# EAGLE design poas (EAGLE 9.7.0)
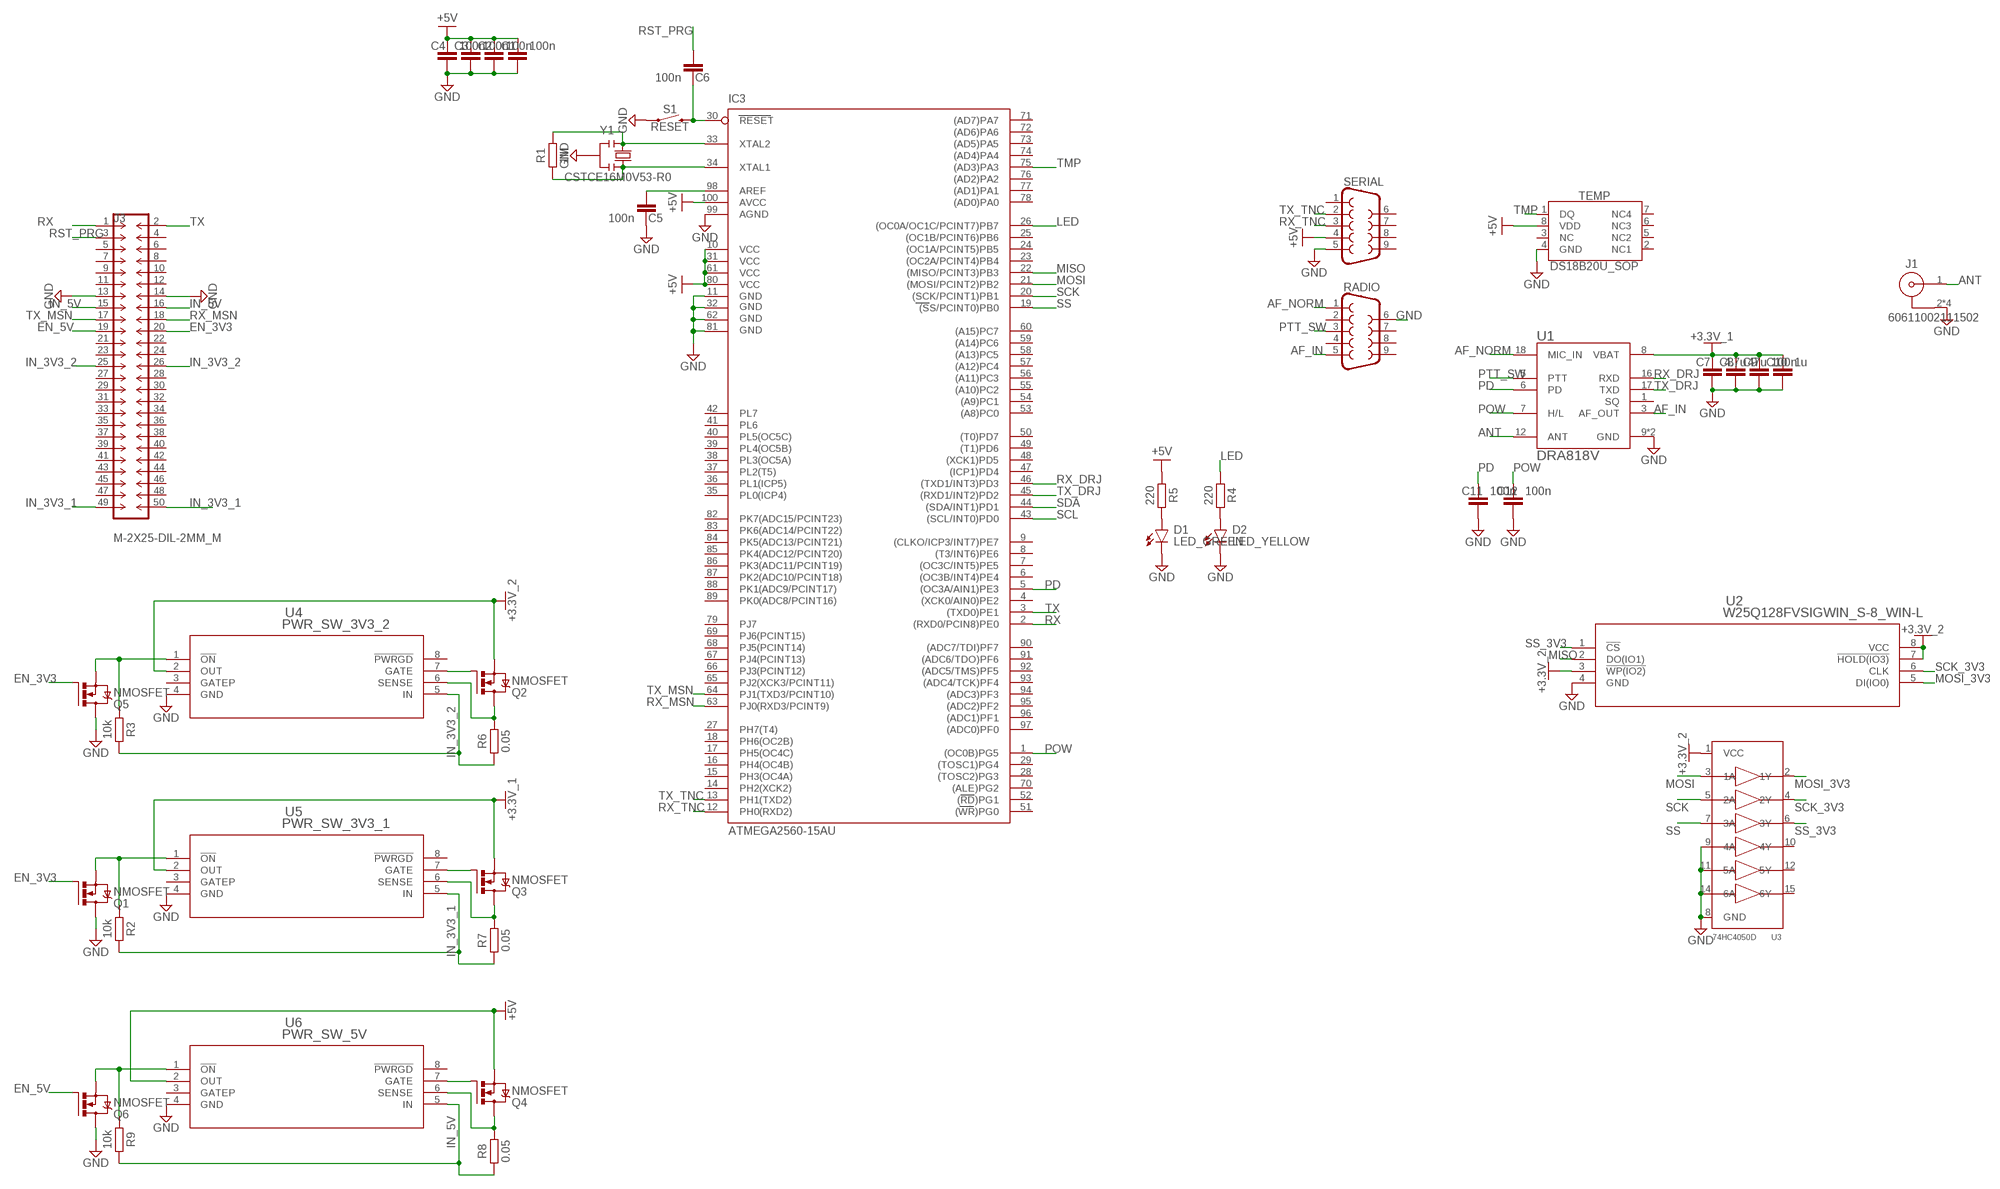
[diagram p0: schematic, sheet 1]

## Parts
C1  100n  C_CHIP-0603(1608-METRIC)  [CAPC1608X85]
C2  100n  C_CHIP-0603(1608-METRIC)  [CAPC1608X85]
C3  100n  C_CHIP-0603(1608-METRIC)  [CAPC1608X85]
C4  100n  C_CHIP-0603(1608-METRIC)  [CAPC1608X85]
C5  100n  C_CHIP-0603(1608-METRIC)  [CAPC1608X85]
C6  100n  C_CHIP-0603(1608-METRIC)  [CAPC1608X85]
C7  4.7u  C_CHIP-0603(1608-METRIC)  [CAPC1608X85]
C8  47u  C_CHIP-0603(1608-METRIC)  [CAPC1608X85]
C9  100n  C_CHIP-0603(1608-METRIC)  [CAPC1608X85]
C10  1u  C_CHIP-0603(1608-METRIC)  [CAPC1608X85]
C11  100n  C_CHIP-0603(1608-METRIC)  [CAPC1608X85]
C12  100n  C_CHIP-0603(1608-METRIC)  [CAPC1608X85]
D1  LED_GREEN  CHIP-FLAT-G_0603-0.55MM  [LEDC1608X55N_FLAT-G]
D2  LED_YELLOW  CHIP-FLAT-Y_0603-0.55MM  [LEDC1608X55N_FLAT-Y]
IC3  ATMEGA2560-15AU  0023_ATMEGA2560-16AU  [TQFP100]
J1  60611002111502  [60611002111502]
J3  M-2X25-DIL-2MM_M  [DIL-2MM-2X25_M]
Q1  NMOSFET  NMOSFETSOT23-GSD  [SOT23]
Q2  NMOSFET  NMOSFETSOT23-GSD  [SOT23]
Q3  NMOSFET  NMOSFETSOT23-GSD  [SOT23]
Q4  NMOSFET  NMOSFETSOT23-GSD  [SOT23]
Q5  NMOSFET  NMOSFETSOT23-GSD  [SOT23]
Q6  NMOSFET  NMOSFETSOT23-GSD  [SOT23]
R1  1M  R_CHIP-0603(1608-METRIC)  [RESC1608X60]
R2  10k  R_CHIP-0603(1608-METRIC)  [RESC1608X60]
R3  10k  R_CHIP-0603(1608-METRIC)  [RESC1608X60]
R4  220  R_CHIP-0603(1608-METRIC)  [RESC1608X60]
R5  220  R_CHIP-0603(1608-METRIC)  [RESC1608X60]
R6  0.05  R_CHIP-0603(1608-METRIC)  [RESC1608X60]
R7  0.05  R_CHIP-0603(1608-METRIC)  [RESC1608X60]
R8  0.05  R_CHIP-0603(1608-METRIC)  [RESC1608X60]
R9  10k  R_CHIP-0603(1608-METRIC)  [RESC1608X60]
RADIO  DB9MALE  [DB9_MALE]
S1  RESET  MOMENTARY-SWITCH-SPST-SMD-6.2MM-TALL  [TACTILE_SWITCH_SMD_6.2MM_TALL]
SERIAL  DB9MALE  [DB9_MALE]
TEMP  DS18B20U_SOP  [SOP65P491X110-8N]
U1  DRA818V  [DORJI_DRA818V]
U2  W25Q128FVSIGWIN_S-8_WIN-L  [WIN_S-8_WIN-L]
U3  74HC4050D  74HC4050DTSSOP  [TSSOP16]
U4  PWR_SW_3V3_2  LTC4361CTS8-2TRMPBFTSOT-23_TS8_LIT-L  [TSOT-23_TS8_LIT-L]
U5  PWR_SW_3V3_1  LTC4361CTS8-2TRMPBFTSOT-23_TS8_LIT-L  [TSOT-23_TS8_LIT-L]
U6  PWR_SW_5V  LTC4361CTS8-2TRMPBFTSOT-23_TS8_LIT-L  [TSOT-23_TS8_LIT-L]
Y1  CSTCE16M0V53-R0  0011_CSTCE16M0V53-R0  [RESONATOR]

## Nets
+3.3V_1: C7.1 C8.1 C9.1 C10.1 Q3.2(S) U1.8(VBAT) U5.2(OUT)
+3.3V_2: Q2.2(S) U2.3(!WP(IO2)) U2.7(!HOLD(IO3)) U2.8(VCC) U3.1(VCC) U4.2(OUT)
+5V: C1.1 C2.1 C3.1 C4.1 IC3.10(VCC) IC3.31(VCC1) IC3.61(VCC2) IC3.80(VCC3) IC3.100(AVCC) Q4.2(S) R5.1 SERIAL.4 TEMP.8(VDD) U6.2(OUT)
AF_IN: RADIO.5 U1.3(AF_OUT)
AF_NORM: RADIO.1 U1.18(MIC_IN)
ANT: J1.1 U1.12(ANT)
EN_3V3: J3.20 Q1.1(G) Q5.1(G)
EN_5V: J3.19 Q6.1(G)
GND: C1.2 C2.2 C3.2 C4.2 C5.1 C7.2 C8.2 C9.2 C10.2 C11.2 C12.2 D1.C D2.C IC3.11(GND) IC3.32(GND1) IC3.62(GND2) IC3.81(GND3) IC3.99(AGND) J1.2 J1.3 J1.4 J1.5 J3.13 J3.14 Q1.3(D) Q5.3(D) Q6.3(D) RADIO.6 S1.A2 SERIAL.5 TEMP.4(GND) U1.9(GND) U1.10(GND) U2.4(GND) U3.8(GND) U3.9(4A) U3.11(5A) U3.14(6A) U4.4(GND) U5.4(GND) U6.4(GND) Y1.2
IN_3V3_1: J3.49 J3.50 R2.2 R7.1 U5.5(IN)
IN_3V3_2: J3.25 J3.26 R3.2 R6.1 U4.5(IN)
IN_5V: J3.15 J3.16 R8.1 R9.2 U6.5(IN)
LED: IC3.26((OC0A/OC1C/PCINT7)PB7) R4.1
MISO: IC3.22((MISO/PCINT3)PB3) U2.2(DO(IO1))
MOSI: IC3.21((MOSI/PCINT2)PB2) U3.3(1A)
MOSI_3V3: U2.5(DI(IO0)) U3.2(1Y)
N$1: C5.2 IC3.98(AREF)
N$2: Q5.2(S) R3.1 U4.1(!ON)
N$3: Q1.2(S) R2.1 U5.1(!ON)
N$4: D1.A R5.2
N$5: D2.A R4.2
N$6: Q2.1(G) U4.7(GATE)
N$7: Q2.3(D) R6.2 U4.6(SENSE)
N$8: Q3.1(G) U5.7(GATE)
N$9: Q3.3(D) R7.2 U5.6(SENSE)
N$10: Q4.1(G) U6.7(GATE)
N$11: Q4.3(D) R8.2 U6.6(SENSE)
N$12: Q6.2(S) R9.1 U6.1(!ON)
PD: C11.1 IC3.5((OC3A/AIN1)PE3) U1.6(PD)
POW: C12.1 IC3.1((OC0B)PG5) U1.7(H/L)
PTT_SW: RADIO.3 U1.5(PTT)
RESET: C6.1 IC3.30(RESET) S1.B2
RST_PRG: C6.2 J3.3
RX: IC3.2((RXD0/PCIN8)PE0) J3.1
RX_DRJ: IC3.46((TXD1/INT3)PD3) U1.16(RXD)
RX_MSN: IC3.63(PJ0(RXD3/PCINT9)) J3.18
RX_TNC: IC3.12(PH0(RXD2)) SERIAL.3
SCK: IC3.20((SCK/PCINT1)PB1) U3.5(2A)
SCK_3V3: U2.6(CLK) U3.4(2Y)
SCL: IC3.43((SCL/INT0)PD0)
SDA: IC3.44((SDA/INT1)PD1)
SS: IC3.19((SS/PCINT0)PB0) U3.7(3A)
SS_3V3: U2.1(!CS) U3.6(3Y)
TMP: IC3.75((AD3)PA3) TEMP.1(DQ)
TX: IC3.3((TXD0)PE1) J3.2
TX_DRJ: IC3.45((RXD1/INT2)PD2) U1.17(TXD)
TX_MSN: IC3.64(PJ1(TXD3/PCINT10)) J3.17
TX_TNC: IC3.13(PH1(TXD2)) SERIAL.2
XTAL1: IC3.33(XTAL2) R1.2 Y1.1
XTAL2: IC3.34(XTAL1) R1.1 Y1.3
Unconnected: IC3.4((XCK0/AIN0)PE2) IC3.6((OC3B/INT4)PE4) IC3.7((OC3C/INT5)PE5) IC3.8((T3/INT6)PE6) IC3.9((CLKO/ICP3/INT7)PE7) IC3.14(PH2(XCK2)) IC3.15(PH3(OC4A)) IC3.16(PH4(OC4B)) IC3.17(PH5(OC4C)) IC3.18(PH6(OC2B)) IC3.23((OC2A/PCINT4)PB4) IC3.24((OC1A/PCINT5)PB5) IC3.25((OC1B/PCINT6)PB6) IC3.27(PH7(T4)) IC3.28((TOSC2)PG3) IC3.29((TOSC1)PG4) IC3.35(PL0(ICP4)) IC3.36(PL1(ICP5)) IC3.37(PL2(T5)) IC3.38(PL3(OC5A)) IC3.39(PL4(OC5B)) IC3.40(PL5(OC5C)) IC3.41(PL6) IC3.42(PL7) IC3.47((ICP1)PD4) IC3.48((XCK1)PD5) IC3.49((T1)PD6) IC3.50((T0)PD7) IC3.51((WR)PG0) IC3.52((RD)PG1) IC3.53((A8)PC0) IC3.54((A9)PC1) IC3.55((A10)PC2) IC3.56((A11)PC3) IC3.57((A12)PC4) IC3.58((A13)PC5) IC3.59((A14)PC6) IC3.60((A15)PC7) IC3.65(PJ2(XCK3/PCINT11)) IC3.66(PJ3(PCINT12)) IC3.67(PJ4(PCINT13)) IC3.68(PJ5(PCINT14)) IC3.69(PJ6(PCINT15)) IC3.70((ALE)PG2) IC3.71((AD7)PA7) IC3.72((AD6)PA6) IC3.73((AD5)PA5) IC3.74((AD4)PA4) IC3.76((AD2)PA2) IC3.77((AD1)PA1) IC3.78((AD0)PA0) IC3.79(PJ7) IC3.82(PK7(ADC15/PCINT23)) IC3.83(PK6(ADC14/PCINT22)) IC3.84(PK5(ADC13/PCINT21)) IC3.85(PK4(ADC12/PCINT20)) IC3.86(PK3(ADC11/PCINT19)) IC3.87(PK2(ADC10/PCINT18)) IC3.88(PK1(ADC9/PCINT17)) IC3.89(PK0(ADC8/PCINT16)) IC3.90((ADC7/TDI)PF7) IC3.91((ADC6/TDO)PF6) IC3.92((ADC5/TMS)PF5) IC3.93((ADC4/TCK)PF4) IC3.94((ADC3)PF3) IC3.95((ADC2)PF2) IC3.96((ADC1)PF1) IC3.97((ADC0)PF0) J3.4 J3.5 J3.6 J3.7 J3.8 J3.9 J3.10 J3.11 J3.12 J3.21 J3.22 J3.23 J3.24 J3.27 J3.28 J3.29 J3.30 J3.31 J3.32 J3.33 J3.34 J3.35 J3.36 J3.37 J3.38 J3.39 J3.40 J3.41 J3.42 J3.43 J3.44 J3.45 J3.46 J3.47 J3.48 RADIO.2 RADIO.4 RADIO.7 RADIO.8 RADIO.9 SERIAL.1 SERIAL.6 SERIAL.7 SERIAL.8 SERIAL.9 TEMP.2(NC1) TEMP.3(NC) TEMP.5(NC2) TEMP.6(NC3) TEMP.7(NC4) U1.1(SQ) U3.10(4Y) U3.12(5Y) U3.15(6Y) U4.3(GATEP) U4.8(!PWRGD) U5.3(GATEP) U5.8(!PWRGD) U6.3(GATEP) U6.8(!PWRGD)

## Library data of the parts
C1-C12 = Capacitor:C: Capacitor - Generic; CATEGORY: Capacitor
D1 = LED:CHIP-FLAT-G; CATEGORY: LED; COLOR: GREEN; DESCRIPTION: CHIP LED FLAT; SUB-CATEGORY: CHIP; TYPE: FLAT_TOP
D2 = LED:CHIP-FLAT-Y; CATEGORY: LED; COLOR: YELLOW; DESCRIPTION: CHIP LED FLAT; SUB-CATEGORY: CHIP; TYPE: FLAT_TOP
IC3 = IntegratedCircuits:0023_ATMEGA2560-16AU: 8-bit Microcontroller with 256K Bytes In-System Programmable Flash - ATMEGA2560-16AU; CASE: TQFP100_14x14; MONTHLY_USAGE: _____; PART_NUMBER: ATMEGA2560-16AU; PRICE: _____; SUPPLIER: _____; TYPE: Circuito_Integrato
J1 = Wurth_Connectors_WR-MCX:60611002111502: WR-MCX Right Angle Solder Leg 1.73mm MATERIAL PROPERTIES Insulator Material PTFE Center Contact Material Beryllium Copper Center Contact Plating Gold, min. 0.076µm over Nickel Body Material Brass Body Plating Gold, min. 0.076µm over Nickel KIND PROPERTIES Interface IEC 61169-36 Connector Type MCX Gender Jack Orientation Type Right Angle GENERAL INFORMATION Operating Temperature -55 up to +155 °C ELECTRICAL PROPERTIES Impedance 50 Ω Frequency Range DC~6 GHz MECHANICAL PROPERTIES Mating Cycle 500 Cycles PACKAGINGPROPERTIES Qty. 180 <https://www.we-online.com/catalog/media/o150546v209%20Family_WR-MCX_60611002111502.jpg> Details see: https://www.we-online.com/katalog/en/em/WR-MCX_60611002111502 Updated by Ella Wu 2019-11-04 2019 (C) Würth Elektronik; DATASHEET-URL: https://katalog.we-online.com/em/datasheet/60611002111502.pdf; GENDER: Jack; MOUNT: THT; PART-NUMBER: 60611002111502; Z: 50Ohm
J3 = Library:M-2X25-: MALE HEADER
Q1-Q6 = Transistor:NMOSFET: N-Channel MOSFET - Generic; CATEGORY: Transistor; SUB-CATEGORY: MOSFET; TYPE: N-Channel
R1-R9 = Resistor:R: Resistor Fixed - Generic; CATEGORY: Resistor; SUB-CATEGORY: Fixed
RADIO SERIAL = SparkFun-Connectors:DB9: DB9 Connector Standard DB9 (D-Sub 9) serial connector. Can be used for CAN bus as well as RS485 and RS232. Footprint production proven. Here is the female version connector we sell at SparkFun: 9 Pin Female Serial Connector - PCB Mount <https://www.sparkfun.com/products/429> (PRT-00429) This connector has been used on the following SparkFun products: SparkFun RS232 Shifter - SMD <https://www.sparkfun.com/products/449> (PRT-00449) SparkFun RS232 Shifter SMD (No DB9) <https://www.sparkfun.com/products/8780> (PRT-08780); PROD_ID: CONN-09904
S1 = SparkFun-Switches:MOMENTARY-SWITCH-SPST: Momentary Switch (Pushbutton) - SPST Normally-open (NO) SPST momentary switches (buttons, pushbuttons). Variants PTH-12MM - 12mm square, through-hole Momentary Pushbutton Switch - 12mm Square <https://www.sparkfun.com/products/9190> (COM-09190) PTH-6.0MM, PTH-6.0MM-KIT - 6.0mm square, through-hole Mini Pushbutton Switch <https://www.sparkfun.com/products/97> (COM-00097) KIT package intended for soldering kit's - only one side of pads' copper is exposed. PTH-RIGHT-ANGLE-KIT - Right-angle, through-hole Right Angle Tactile Button <https://www.sparkfun.com/products/10791> - Used on SparkFun BigTime Watch Kit <https://www.sparkfun.com/products/11734> SMD-12MM - 12mm square, surface-mount Tactile Button - SMD (12mm) <https://www.sparkfun.com/products/12993> (COM-12993) Used on SparkFun PicoBoard <https://www.sparkfun.com/products/11888> SMD-4.5MM - 4.5mm Square Trackball Switch Used on SparkFun Blackberry Trackballer Breakout <https://www.sparkfun.com/products/13169> SMD-4.6MMX2.8MM - 4.60mm x 2.80mm, surface mount Used on SparkFun SAMD21 Mini Breakout <https://www.sparkfun.com/products/13664> SMD-5.2MM, SMD-5.2-REDUNDANT - 5.2mm square, surface-mount Mini Pushbutton Switch - SMD <https://www.sparkfun.com/products/8720> (COM-08720) Used on Arduino Pro Mini <https://www.sparkfun.com/products/11114> REDUNDANT package connects both switch circuits together SMD-6.0X3.5MM - 6.0 x 3.5mm, surface mount Momentary Reset Switch SMD <https://www.sparkfun.com/products/8229> (COM-08229) SMD-6.2MM-TALL - 6.2mm square, surface mount Tactile Button - SMD (6mm) <https://www.sparkfun.com/products/12992> Used on SparkFun Digital Sandbox <https://www.sparkfun.com/products/12651> SMD-RIGHT-ANGLE - Right-angle, surface mount Used on SparkFun Block for Intel® Edison - Arduino <https://www.sparkfun.com/products/13036>; PROD_ID: SWCH-11966; SF_SKU: COM-12992
TEMP = Sensor:DS18B20U: Programmable Resolution 1-Wire Digital Thermometer. Datasheet <https://datasheets.maximintegrated.com/en/ds/DS18B20.pdf>
U1 = DRA818V:DRA818V: VHF Band Voice Transceiver Module; MANUFACTURER: DORJI; PART_REV: 1.23; STANDARD: MANUFACTURER RECOMMENDATIONS
U2 = 2023-07-10_06-57-03_Library:W25Q128FVSIG; COPYRIGHT: Copyright (C) 2023 Ultra Librarian. All rights reserved.; MANUFACTURER_PART_NUMBER: W25Q128FVSIG; MFR_NAME: Winbond
U3 = microbuilder:74HC4050D: 6-channel level shifter 74HC4050D - 2V-6V Supply SOIC16 Digikey: 74HC4050D,653-ND Mouser: 771-74HC4050D-T TSSOP16 Digikey: 296-9215-1-ND Mouser:
U4-U6 = 2023-07-11_07-55-04_Library:LTC4361CTS8-2TRMPBF; COPYRIGHT: Copyright (C) 2023 Ultra Librarian. All rights reserved.; MANUFACTURER_PART_NUMBER: LTC4361CTS8-2#TRMPBF; MFR_NAME: Analog Devices Inc
Y1 = Cristalli:0011_CSTCE16M0V53-R0: 16Mhz - SMD; MONTHLY_USAGE: _____; PART_NUMBER: CSTCE16M0V53-R0; PRICE: _____; SUPPLIER: _____; TYPE: Cristalli

## Board
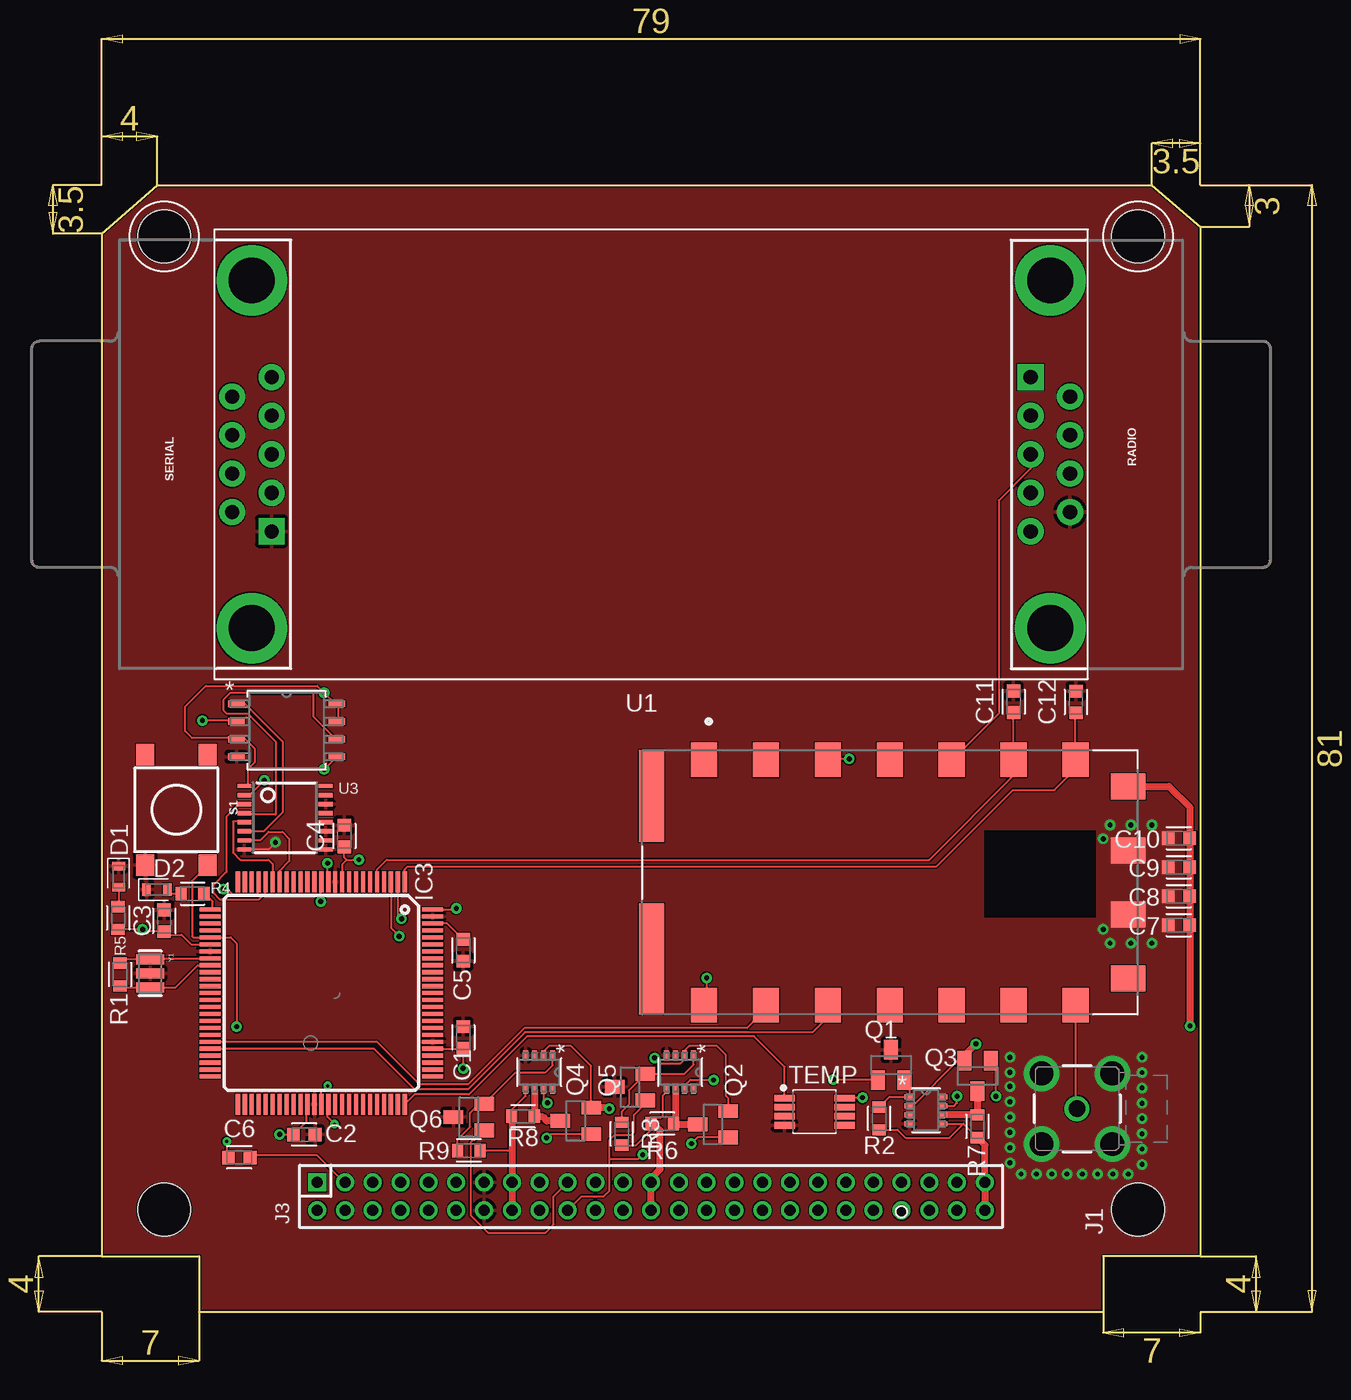
[diagram p1: board, top side]
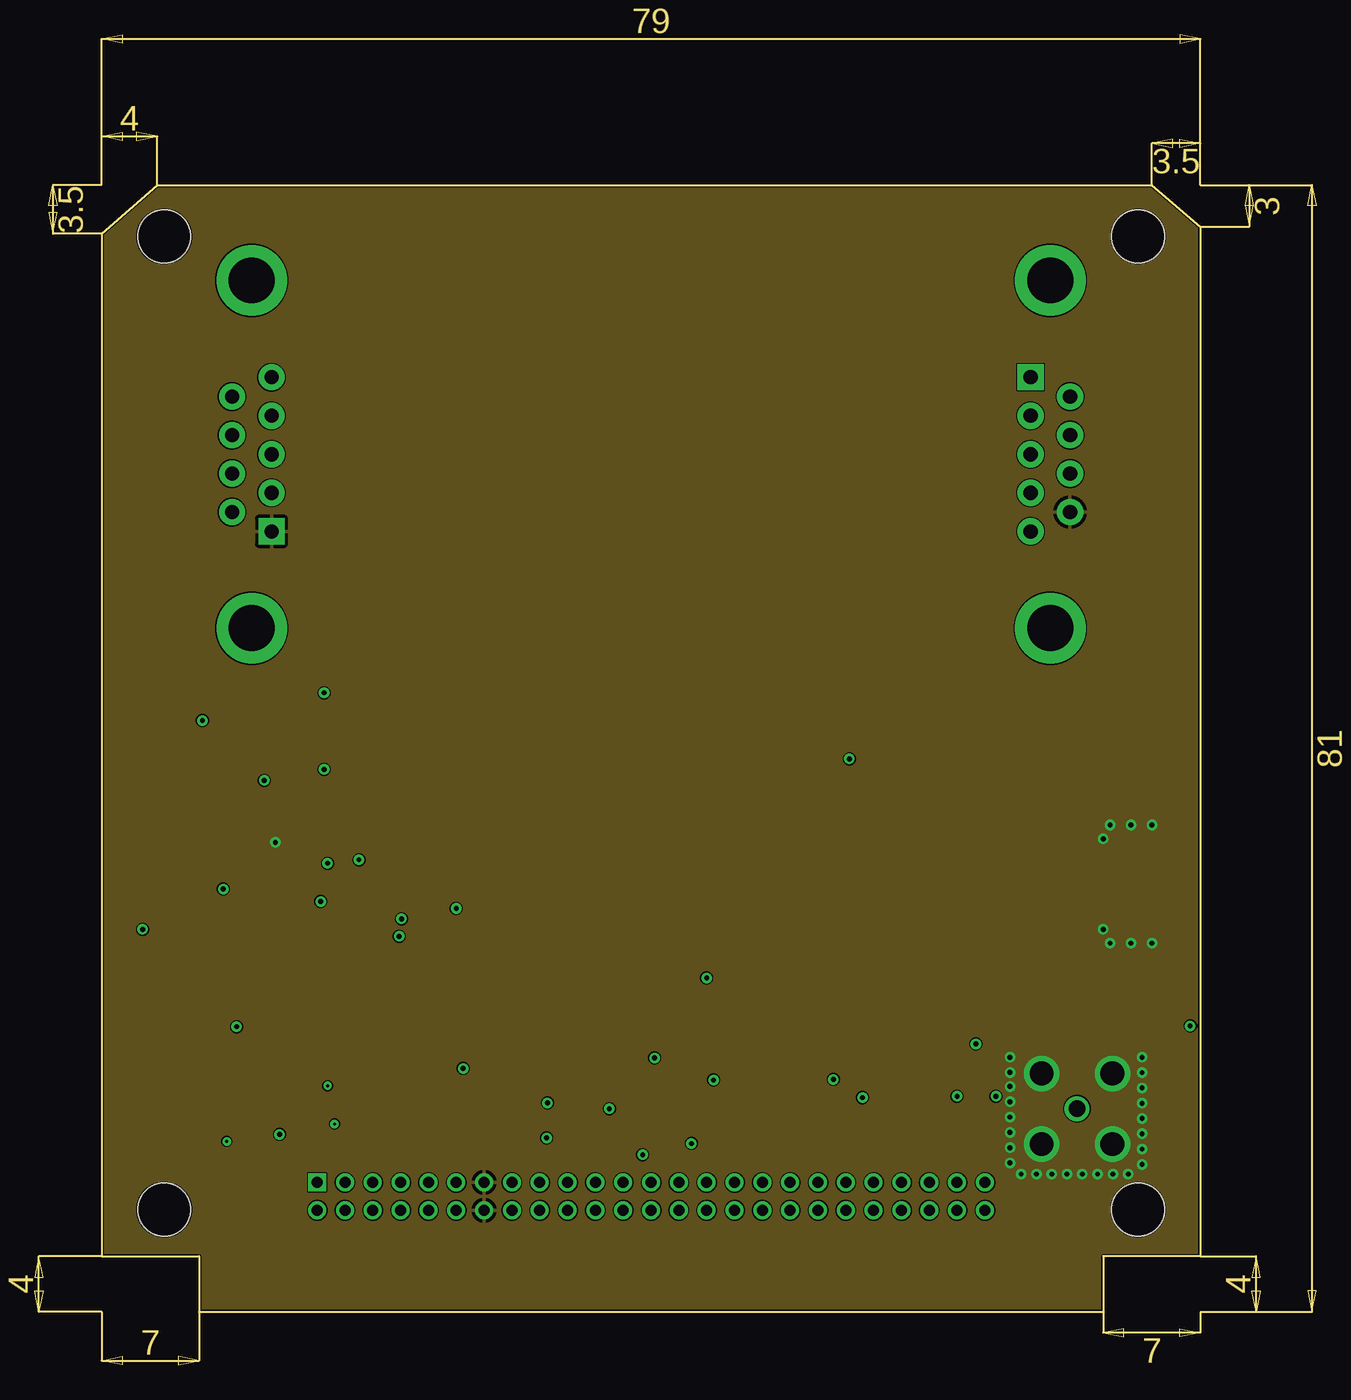
[diagram p2: board, inner layer Route2]
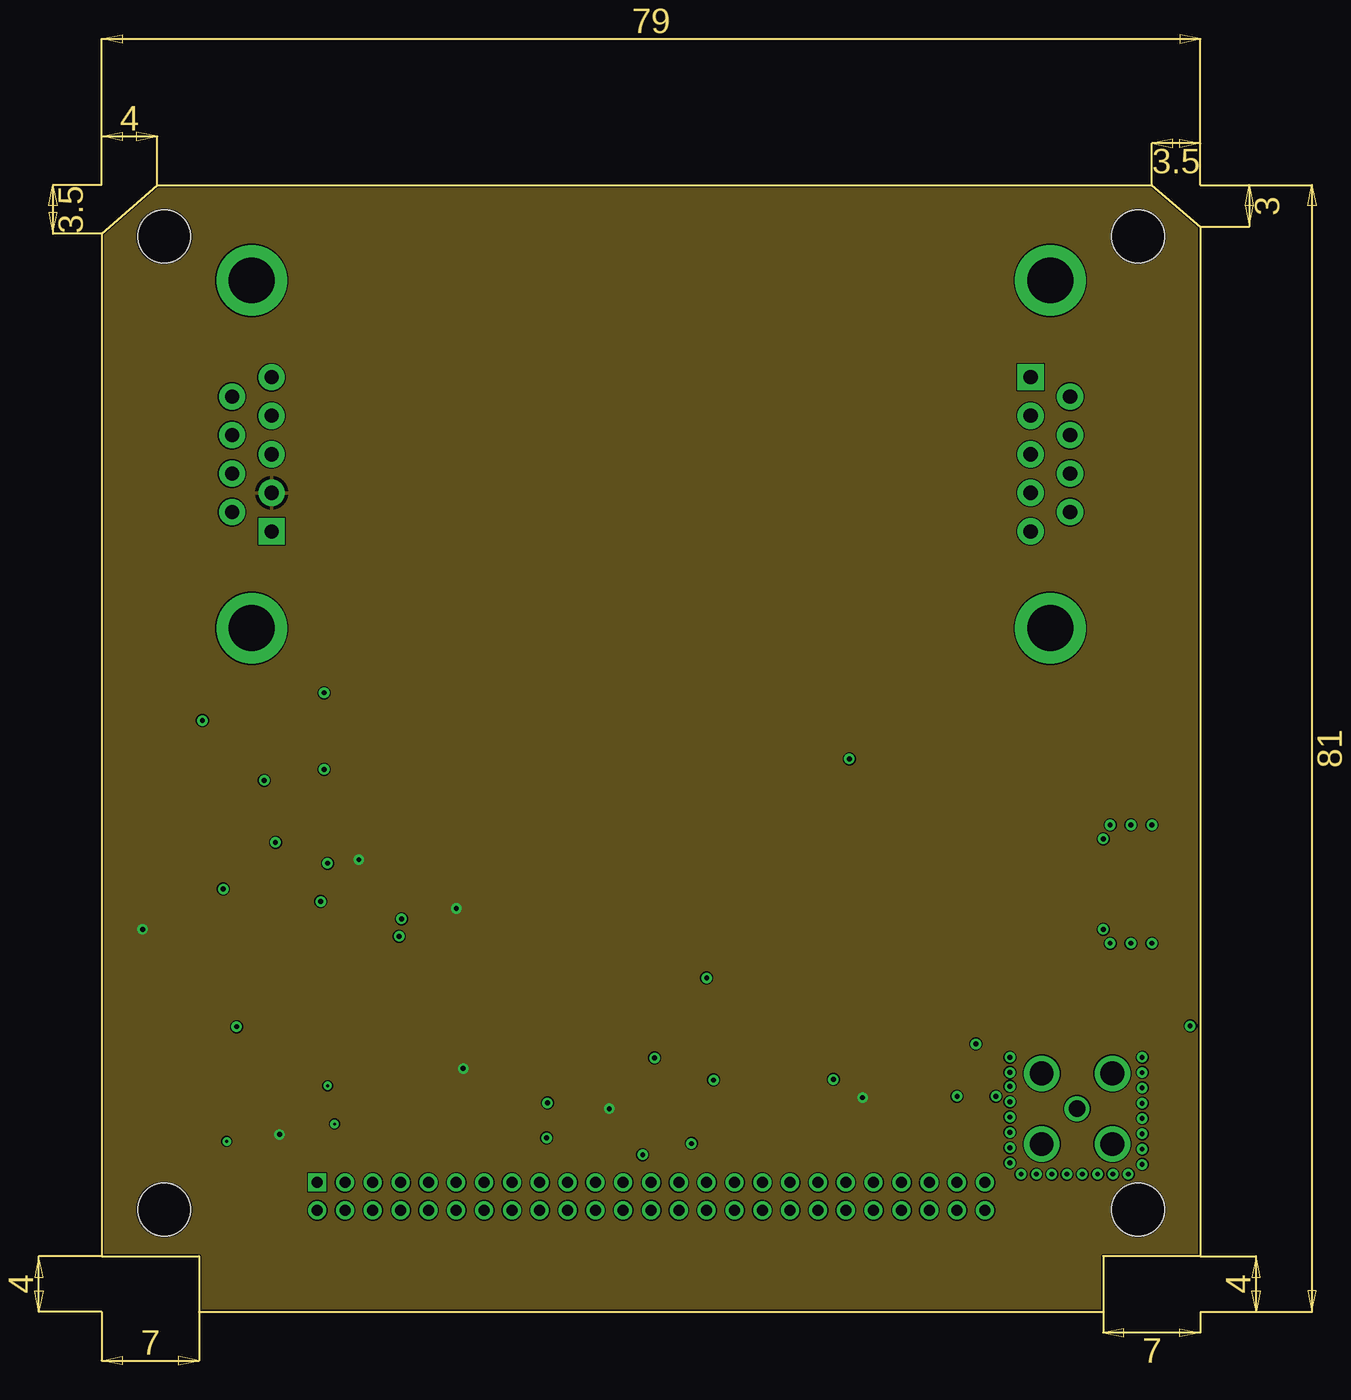
[diagram p3: board, inner layer Route15]
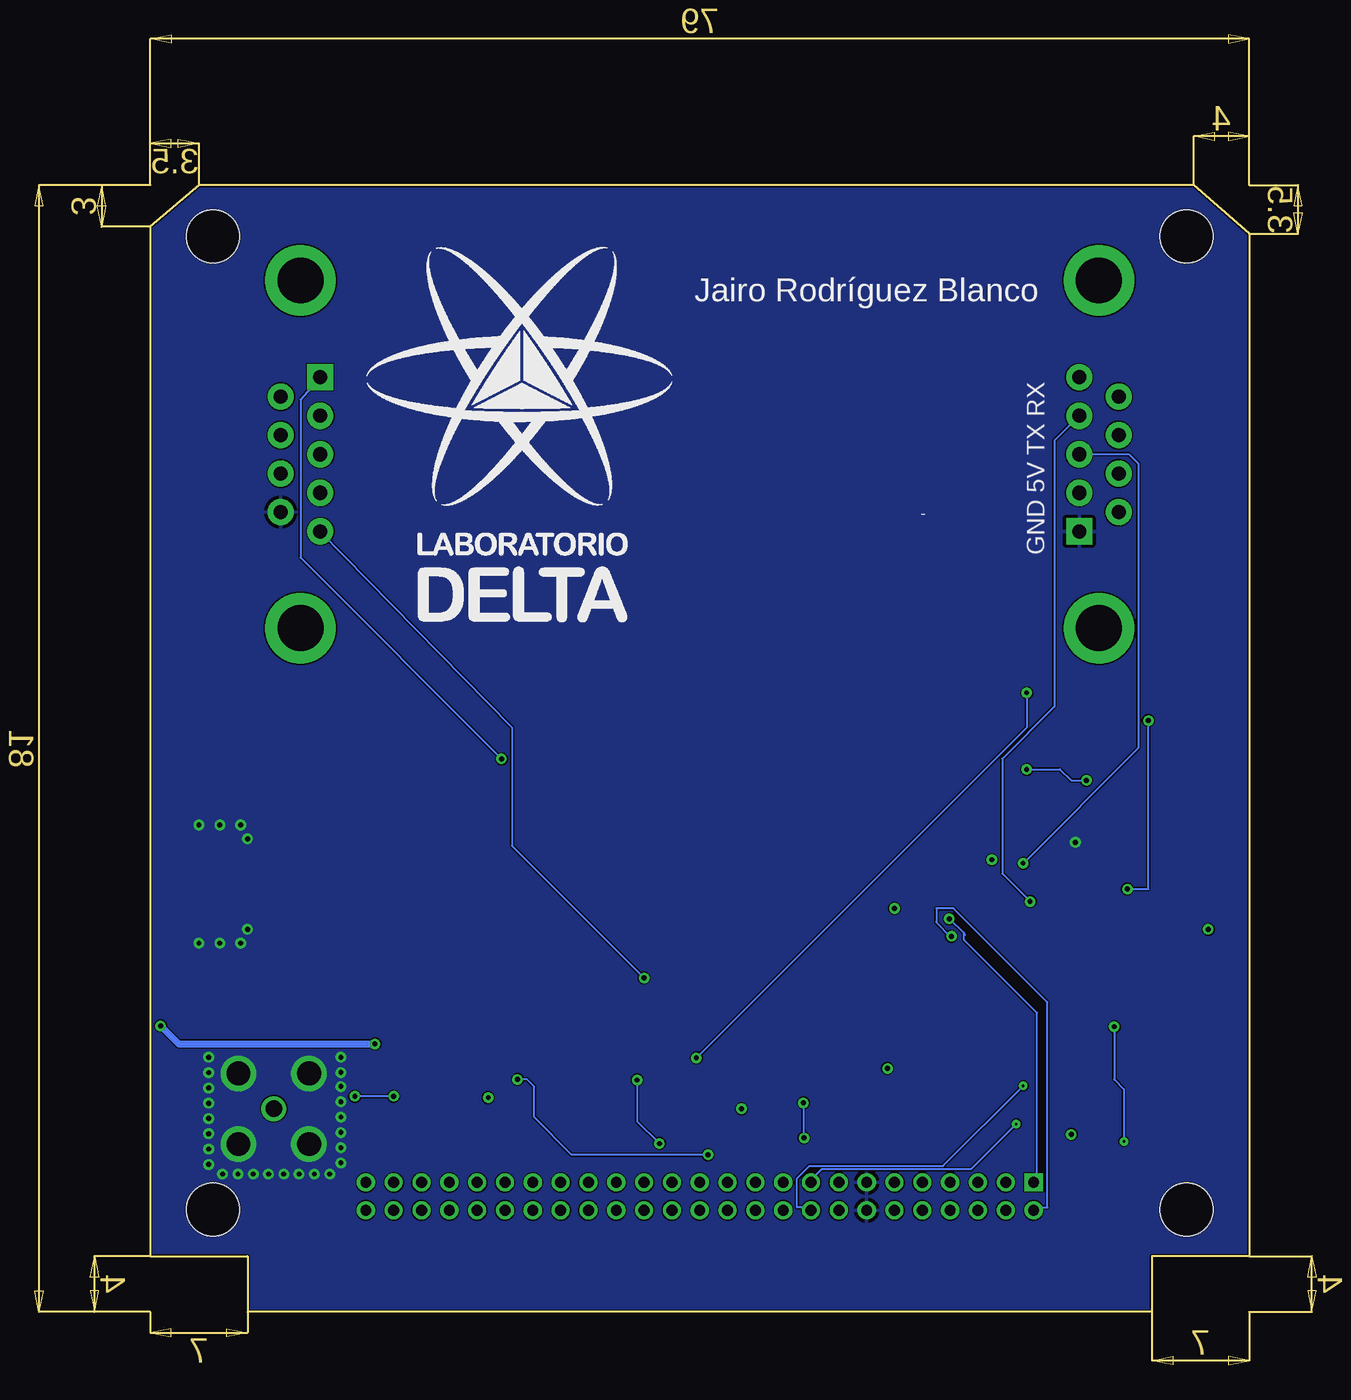
[diagram p4: board, bottom side, seen from below]

Size 79 x 81 mm. Coordinates in mm from the lower left corner, seen from the top.
Outline: 4,81 75.5,81 79,78 79,4 72,4 72,0 7,0 7,4 0,4 0,77.5 4,81
Copper layers (1+2*15+16): Top 0.035mm / dielectric 1.5mm / Route2 0.035mm / dielectric 0.15mm / Route15 0.035mm / dielectric 0.2mm / Bottom 0.035mm
Design rules "default *": minimum track width 6mil, minimum drill 0.2mm, track to track 0.09mm, track to pad 0.2mm, pad to pad 5mil, via to via 10mil, smd to smd 5mil, copper to edge 0.1mm, drill to drill 0.2mm, minimum pad ring 10mil, minimum via ring 8mil, stop-mask expansion 4mil, vias tented up to drill 0mil, thermal gap 10mil
Holes 3.8 mm at 4.5,77.3 74.5,77.3 74.5,7.35 4.5,7.35

### Footprints (pad centres in the part's own frame; a part is rotated, then mirrored left to right if it is on the bottom)
CAPC1608X85 = smd 0.921 x 0.97: 1 -0.775,0; 2 0.775,0
LEDC1608X55N_FLAT-G = smd 0.612 x 0.912: A 0.75,0; C -0.75,0
LEDC1608X55N_FLAT-Y = smd 0.612 x 0.912: A 0.75,0; C -0.75,0
TQFP100 = smd 1.5 x 0.3: 1 -8,6; 2 -8,5.5; 3 -8,5; 4 -8,4.5; 5 -8,4; 6 -8,3.5; 7 -8,3; 8 -8,2.5; 9 -8,2; 10 -8,1.5; 11 -8,1; 12 -8,0.5; 13 -8,0; 14 -8,-0.5; 15 -8,-1; 16 -8,-1.5; 17 -8,-2; 18 -8,-2.5; 19 -8,-3; 20 -8,-3.5; 21 -8,-4; 22 -8,-4.5; 23 -8,-5; 24 -8,-5.5; 25 -8,-6; 51 8,-6; 52 8,-5.5; 53 8,-5; 54 8,-4.5; 55 8,-4; 56 8,-3.5; 57 8,-3; 58 8,-2.5; 59 8,-2; 60 8,-1.5; 61 8,-1; 62 8,-0.5; 63 8,0; 64 8,0.5; 65 8,1; 66 8,1.5; 67 8,2; 68 8,2.5; 69 8,3; 70 8,3.5; 71 8,4; 72 8,4.5; 73 8,5; 74 8,5.5; 75 8,6 | smd 0.3 x 1.5: 26 -6,-8; 27 -5.5,-8; 28 -5,-8; 29 -4.5,-8; 30 -4,-8; 31 -3.5,-8; 32 -3,-8; 33 -2.5,-8; 34 -2,-8; 35 -1.5,-8; 36 -1,-8; 37 -0.5,-8; 38 0,-8; 39 0.5,-8; 40 1,-8; 41 1.5,-8; 42 2,-8; 43 2.5,-8; 44 3,-8; 45 3.5,-8; 46 4,-8; 47 4.5,-8; 48 5,-8; 49 5.5,-8; 50 6,-8; 76 6,8; 77 5.5,8; 78 5,8; 79 4.5,8; 80 4,8; 81 3.5,8; 82 3,8; 83 2.5,8; 84 2,8; 85 1.5,8; 86 1,8; 87 0.5,8; 88 0,8; 89 -0.5,8; 90 -1,8; 91 -1.5,8; 92 -2,8; 93 -2.5,8; 94 -3,8; 95 -3.5,8; 96 -4,8; 97 -4.5,8; 98 -5,8; 99 -5.5,8; 100 -6,8
60611002111502 = drill 1.2: 1 0,0 | drill 1.7: 2 -2.54,2.54; 3 2.54,2.54; 4 2.54,-2.54; 5 -2.54,-2.54
DIL-2MM-2X25_M = drill 0.787 square: 1 -24,1 | drill 0.787: 2 -24,-1; 3 -22,1; 4 -22,-1; 5 -20,1; 6 -20,-1; 7 -18,1; 8 -18,-1; 9 -16,1; 10 -16,-1; 11 -14,1; 12 -14,-1; 13 -12,1; 14 -12,-1; 15 -10,1; 16 -10,-1; 17 -8,1; 18 -8,-1; 19 -6,1; 20 -6,-1; 21 -4,1; 22 -4,-1; 23 -2,1; 24 -2,-1; 25 0,1; 26 0,-1; 27 2,1; 28 2,-1; 29 4,1; 30 4,-1; 31 6,1; 32 6,-1; 33 8,-1; 34 8,1; 35 10,-1; 36 10,1; 37 12,-1; 38 12,1; 39 14,-1; 40 14,1; 41 16,1; 42 16,-1; 43 18,1; 44 18,-1; 45 20,-1; 46 20,1; 47 22,-1; 48 22,1; 49 24,1; 50 24,-1
SOT23 = smd 1 x 1.4: 1 -0.95,-1.1; 2 0.95,-1.1; 3 0,1.1
RESC1608X60 = smd 0.799 x 0.974: 1 -0.815,0; 2 0.815,0
DB9_MALE = drill 1.016 pad 1.88: 1 5.54,-1.42; 2 2.77,-1.42; 3 0,-1.42; 4 -2.77,-1.42; 6 4.15,1.42; 7 1.38,1.42; 8 -1.38,1.42; 9 -4.15,1.42 | drill 1.016 pad 1.88 square: 5 -5.54,-1.42 | drill 3.302 pad 5.08: G1 -12.5,0; G2 12.5,0
TACTILE_SWITCH_SMD_6.2MM_TALL = smd 1.55 x 1.3: A1 -3.975,-2.25; A2 3.975,-2.25; B1 -3.975,2.25; B2 3.975,2.25
SOP65P491X110-8N = smd 1.472 x 0.485: 1 -2.155,0.975; 2 -2.155,0.325; 3 -2.155,-0.325; 4 -2.155,-0.975; 5 2.155,-0.975; 6 2.155,-0.325; 7 2.155,0.325; 8 2.155,0.975
DORJI_DRA818V = smd 1.88 x 2.47: 1 -13.35,8.825; 2 -8.9,8.825; 3 -4.45,8.825; 4 0,8.825; 5 4.45,8.825; 6 8.9,8.825; 7 13.35,8.825; 12 13.35,-8.825; 13 8.9,-8.825; 14 4.45,-8.825; 15 0,-8.825; 16 -4.45,-8.825; 17 -8.9,-8.825; 18 -13.35,-8.825 | smd 2.47 x 1.88: 8 17.125,6.9; 9 17.125,2.3; 10 17.125,-2.3; 11 17.125,-6.9 | smd 1.8 x 6.6: P2 -17.125,6.2 | smd 1.8 x 8: P3 -17.125,-5.5
WIN_S-8_WIN-L = smd 1.194 x 0.483: 1 -3.607,1.905; 2 -3.607,0.635; 3 -3.607,-0.635; 4 -3.607,-1.905; 5 3.607,-1.905; 6 3.607,-0.635; 7 3.607,0.635; 8 3.607,1.905
TSSOP16 = smd 0.305 x 0.991: 1 -2.275,-2.918; 2 -1.625,-2.918; 3 -0.975,-2.918; 4 -0.325,-2.918; 5 0.325,-2.918; 6 0.975,-2.918; 7 1.625,-2.918; 8 2.275,-2.918; 9 2.275,2.918; 10 1.625,2.918; 11 0.975,2.918; 12 0.325,2.918; 13 -0.325,2.918; 14 -0.975,2.918; 15 -1.625,2.918; 16 -2.275,2.918
TSOT-23_TS8_LIT-L = smd 0.673 x 0.356: 1 -1.213,0.975; 2 -1.213,0.325; 3 -1.213,-0.325; 4 -1.213,-0.975; 5 1.213,-0.975; 6 1.213,-0.325; 7 1.213,0.325; 8 1.213,0.975
RESONATOR = smd 0.7 x 2: 1 -1,0; 2 0,0; 3 1,0

### Placement (x,y rotation side)
C1  26,19.73 90 top
C2  14.57,12.75 0 top
C3  4.5,28.11 90 top
C4  17.45,34.2 90 top
C5  26,25.99 90 top
C6  9.9,11.1 0 top
C7  77.44,27.8 180 top
C8  77.44,29.88 180 top
C9  77.44,31.96 180 top
C10  77.44,34.04 180 top
C11  65.56,43.86 90 top
C12  70.04,43.84 90 top
D1  1.23,31.29 270 top
D2  3.99,30.35 0 top
IC3  15.8,22.92 270 top
J1  70.12,14.6 270 top
J3  39.5,8.3 0 top
Q1  56.75,17.75 0 top
Q2  43.95,13.48 90 top
Q3  62.97,16.96 180 top
Q4  34.09,13.73 90 top
Q5  37.99,16.17 90 top
Q6  26.4,14 90 top
R1  1.32,24.25 90 top
R2  55.9,13.9 270 top
R3  37.4,12.8 270 top
R4  6.54,30.06 180 top
R5  1.19,28.31 90 top
R6  40.3,13.53 0 top
R7  62.96,13.34 90 top
R8  30.29,14.06 0 top
R9  26.4,11.6 0 top
RADIO  68.2,61.64 270 top
S1  5.38,36.09 270 top
SERIAL  10.8,61.64 90 top
TEMP  51.25,14.39 0 top
U1  56.66,30.87 0 top
U2  13.3,41.8 0 top
U3  13.18,35.52 270 top
U4  41.59,17.23 270 top
U5  59.27,14.49 0 top
U6  31.46,17.23 270 top
Y1  3.5,24.33 270 top

### Tracks (layer width: path | path; a pad name or v marks a point on that pad's centre or on a via)
+3.3V_1  (via drill 0.35)
  Top 0.152: Q3.2 61.56,18.06 58.31,14.81 U5.2
  Top 0.508: U1.8 76.73,37.77 78.22,36.28 C10.1 C9.1 C8.1 C7.1 78.22,20.58 v78.25,20.55 | v62.85,19.25 62.02,18.42 Q3.2
  Bottom 0.508: v62.85,19.25 76.95,19.25 v78.25,20.55
+3.3V_2  (via drill 0.35)
  Top 0.152: U2.7 17,42.5 17,43.5 U2.8 16.75,43.75 v16,44.5 15.5,45 7.5,45 6,43.5 6,41.75 6.5,41.25 9.5,41.25 U2.3 9.75,41.25 10.25,41.25 11,40.5 11,39.5 10.5,39 10.5,37.75 U3.1 | Q2.2 45.05,15.34 44.87,15.52 44.87,18.48 44.25,19.11 42.24,19.11 41.91,18.78 U4.2 41.75,18.25 41.75,18 41.58,17.83 40.17,17.83 v39.75,18.25
  Bottom 0.152: v39.75,18.25 16,42 v16,44.5
+5V  (via drill 0.35)
  Top 0.152: IC3.31 6.44,26.42 5.75,27.11 4.73,27.11 C3.1 3.12,27.33 v2.95,27.5 R5.1 | v12.8,12.75 C2.1 14.73,13.68 14.73,14.84 IC3.61 | IC3.80 25.96,18.92 C1.1 v26,17.5 | IC3.100 25.42,28.92 v25.5,29 | IC3.10 17.3,32.17 17.62,32.5 | 17.62,32.5 v18.5,32.5 | C4.1 17.45,32.67 17.62,32.5 | TEMP.8 54.66,15.36 v54.7,15.4 | U6.2 31.78,18.73 32.16,19.11 33.75,19.11 35.19,17.67 Q4.2
  Top 0.508: v36.5,14.6 36.42,14.68 Q4.2
  pour Route15: 0.08,0.08 78.92,0.08 78.92,80.92 0.08,80.92
AF_IN  (via drill 0.35)
  Top 0.152: v53.75,39.75 52.25,39.75 U1.3
  Bottom 0.152: RADIO.5 68.2,65.58 68.2,54.2 v53.75,39.75
AF_NORM  (via drill 0.35)
  Top 0.152: v43.5,24 43.5,22.25 U1.18
  Bottom 0.152: v43.5,24 53,33.5 53,42 RADIO.1
ANT
  Top 0.152: U1.12 70.01,14.71 J1.1
EN_3V3  (via drill 0.35)
  Top 0.152: J3.20 34.5,8.3 36.1,8.3 36.5,8.7 36.5,11 | Q5.1 39.09,14.99 38.26,14.16 38.26,12.9 38.1,12.74 36.88,12.74 36.5,12.36 36.5,11 | 36.5,11 38.6,11 v38.9,11.3 | v52.6,16.7 55.75,16.7 Q1.1
  Bottom 0.152: v38.9,11.3 48.7,11.3 51.4,14 51.4,16.2 51.9,16.7 v52.6,16.7
EN_5V
  Top 0.152: J3.19 32.5,8.3 32.5,6.3 31.9,5.7 27.79,5.7 26.54,6.95 26.54,12.2 26.7,12.36 26.81,12.36 Q6.1
GND  (via drill 0.35)
  Top 0.152: U3.8 11.99,33.24 v12.5,33.75
  other vias: 75.5,35 75.5,26.5 74,26.5 72.5,26.5 72,27.5 72,34 74,35 72.5,35 72.7,9.9 71.6,9.9 70.5,9.9 69.4,9.9 68.3,9.9 67.2,9.9 66.1,9.9 65.3,10.7 65.3,11.8 65.3,12.9 65.3,14 65.3,15.1 65.3,16.2 65.3,17.21 65.3,18.3 74.8,18.3 74.8,17.2 74.8,16.1 74.8,15 74.8,13.9 74.8,12.8 74.8,11.7 74.8,10.6 73.8,9.9
  pour Route2: 0.08,0.08 78.92,0.08 78.92,80.92 0.08,80.92
  pour Top: 0.08,0.08 78.92,0.08 78.92,80.92 0.08,80.92
  pour Top (no thermals): 72.24,26.25 76.39,26.25 77.2,27.06 77.2,34.99 76.94,35.25 72.26,35.25 71.75,34.74 71.75,26.63
  pour Top: 64.88,9.48 75.22,9.48 75.22,18.72 64.88,18.72
  pour Bottom: 0.08,0.08 78.92,0.08 78.92,80.92 0.08,80.92
IN_3V3_1
  Top 0.152: U5.5 61.97,13.52 | 61.97,13.52 R7.1 | R2.2 57.22,13.08 57.8,12.5 60.95,12.5 61.97,13.52
  Top 0.508: R7.1 62.97,12.53 63.5,12 J3.49 J3.50
IN_3V3_2
  Top 0.152: U4.5 40.62,15.82 40.33,15.53 40.33,14.1 40.16,13.94 39.93,13.94 39.5,13.52 | R3.2 38.41,11.98 39.72,13.3
  Top 0.508: R6.1 39.5,13.52 39.72,13.3 39.88,13.3 40.14,13.03 40.14,10.25 39.5,9.61 J3.25 J3.26
IN_5V
  Top 0.152: U6.5 30.48,15.52 29.48,14.51 R8.1 | R9.2 29.5,11.6
  Top 0.508: R8.1 29.5,14.03 29.5,11.6 J3.15 J3.16
LED
  Top 0.152: R4.1 7.5,30 8,29.5 8,29 IC3.26
MISO  (via drill 0.35)
  Top 0.152: v7.25,42.5 9.5,42.5 U2.2 | IC3.22 11.23,30.84 11.23,30.05 11.06,29.89 9.54,29.89 9.03,30.4 v8.75,30.4
  Bottom 0.152: v7.25,42.5 7.25,30.4 v8.75,30.4
MOSI
  Top 0.152: U3.3 9.88,36.5 9,35.62 9,31.65 8.04,30.69 8.04,30.11 8.5,29.65 11.32,29.65 11.75,30.08 11.75,30.75 IC3.21
MOSI_3V3  (via drill 0.35)
  Top 0.152: v16,39 16.75,39.75 U2.5 | v11.7,38.2 v11.7,38.19 10.65,37.14 U3.2
  Bottom 0.152: v11.7,38.2 12.8,38.2 13.6,39 v16,39
N$1
  Top 0.152: IC3.98 24.85,27.92 C5.2
N$2
  Top 0.152: U4.1 42.56,17.77 41.92,17.12 Q5.2 37.9,15.93 37.9,14.9 37.4,14.4 R3.1
N$3
  Top 0.152: R2.1 56.65,15.47 U5.1 58.06,16.29 Q1.2
N$4
  Top 0.152: D1.A 1.23,29.17 R5.2
N$5
  Top 0.152: D2.A 5.03,30.06 R4.2
N$6  (via drill 0.35)
  Top 0.152: Q2.1 42.83,12.53 v42.4,12.1 | U4.7 41.91,16.27 42.32,16.68 43.98,16.68 v44,16.66
  Bottom 0.152: v44,16.66 44,13.7 v42.4,12.1
N$7
  Top 0.508: U4.6 41.27,13.68 R6.2 41.16,13.48 Q2.3
N$8  (via drill 0.35)
  Top 0.127: 61.3,14.81 61.5,15.01 v61.5,15.5 | v64.29,15.5 64.29,17.69 Q3.1
  Top 0.152: U5.7 61.3,14.81
  Bottom 0.127: v61.5,15.5 v64.29,15.5
N$9
  Top 0.508: U5.6 R7.2 Q3.3
N$10  (via drill 0.35)
  Top 0.152: v32,12.5 32.28,12.78 Q4.1 | U6.7 31.78,15.28 v32.05,15.01
  Bottom 0.152: v32.05,15.01 32.05,12.55 v32,12.5
N$11
  Top 0.152: 31.15,15.95 U6.6 | 31.15,14.25 R8.2 31.15,14
  Top 0.508: 31.15,14.25 31.15,15.95 | 31.15,14 31.73,14 32,13.73 Q4.3
N$12
  Top 0.152: Q6.2 27.58,15.03 | 27.58,15.03 29.75,17.2 31.9,17.2 32.44,17.73 U6.1 | R9.1 25.59,12.39 26.5,13.3 26.5,14.3 27.23,15.03 27.58,15.03
PD
  Top 0.152: IC3.5 19.8,31.8 20.5,32.5 59.5,32.5 65.56,38.56 U1.6 C11.1
POW
  Top 0.152: C12.1 70.01,43.04 U1.7 70.01,39.01 68.5,37.5 65.5,37.5 60,32 22,32 21.8,31.8 IC3.1
PTT_SW
  Top 0.152: U1.5 61.25,39.75 64.5,43 64.5,58.33 66.78,60.61 RADIO.3
RESET  (via drill 0.2, 0.35)
  Top 0.152: S1.B2 6.5,30.98 6.5,27 6.58,26.92 IC3.30 9.28,26.92 9.7,26.5 v9.7,20.5 | v9,12.25 9,11.25 C6.1
  Bottom 0.152: v9.7,20.5 9.7,16.7 9,16 v9,12.25
RST_PRG
  Top 0.152: C6.2 10.75,11.25 15.5,11.25 17.5,9.25 J3.3
RX  (via drill 0.35)
  Top 0.152: IC3.2 21.3,28.51 v21.56,28.25
  Bottom 0.152: 20.41,27.1 20.53,27.22 | 20.53,27.22 v21.56,28.25 | 20.53,27.22 20.5,27.25 20.5,26.75 15.25,21.5 15.25,9.5 15.5,9.5 J3.1
RX_DRJ
  Top 0.152: IC3.46 19.58,18.92 22.5,16 26.34,16 30.44,20.1 51.1,20.1 52.21,21.21 U1.16
RX_MSN  (via drill 0.2)
  Top 0.152: v16.25,16.25 15.75,15.75 15.75,15 IC3.63
  Bottom 0.152: J3.18 31.5,7.5 32.5,7.5 32.5,9.61 31.61,10.49 22.01,10.49 v16.25,16.25
RX_TNC  (via drill 0.35)
  Top 0.152: v16.25,32.25 16.25,31 IC3.12
  Bottom 0.152: SERIAL.3 8.64,61.64 7.98,60.98 7.98,40.52 v16.25,32.25
SCK
  Top 0.127: 9.45,33.02 9.97,32.5 12,32.5 12.3,32.2 IC3.20
  Top 0.152: U3.5 10.25,35.25 9.45,35.25 9.45,33.02
SCK_3V3
  Top 0.152: U3.4 10.5,35.75 12.5,35.75 12.5,41 10.5,43 9,43 8.75,43.25 8.75,44 9.25,44.5 15.25,44.5 15.25,42.75 16.75,41.25 U2.6
SS
  Top 0.152: U3.7 11.39,33.89 12,34.5 13,34.5 13.5,34 13.5,32.41 12.8,31.71 IC3.19
SS_3V3
  Top 0.152: U2.1 9.75,43.75 10.25,43.75 13,41 13,35.91 11.64,34.54 U3.6
TMP
  Top 0.152: IC3.75 22.5,15.62 26.41,15.62 30.6,19.81 46.91,19.81 49.09,17.62 TEMP.1
TX  (via drill 0.35)
  Top 0.152: IC3.3 20.8,27.6 v21.4,27
  Bottom 0.152: v21.4,27 21.5,27 22.5,28 22.5,29 21.25,29 14.5,22.25 14.5,7.5 15.5,7.5 J3.2
TX_DRJ
  Top 0.152: IC3.45 19.79,19.42 22.85,16.35 26.35,16.35 30.4,20.4 46.4,20.4 47.76,21.76 U1.17
TX_MSN  (via drill 0.2)
  Top 0.152: v16.75,13.5 16.25,14 16.25,14.75 IC3.64
  Bottom 0.152: v16.75,13.5 20,10.25 30.75,10.25 31.5,9.5 J3.17
TX_TNC  (via drill 0.35)
  Top 0.152: v15.75,29.5 15.75,30.75 IC3.13
  Bottom 0.152: v15.75,29.5 17.75,31.5 17.75,39.75 14,43.5 14,62.63 SERIAL.2
XTAL1
  Top 0.152: IC3.33 3.59,25.42 Y1.1 3.49,25.32 1.57,25.32 R1.2
XTAL2
  Top 0.152: IC3.34 6.92,24.92 5.33,23.33 Y1.3 1.43,23.33 R1.1

### Text on the board
bPlace: Jairo Rodríguez Blanco | GND 5V TX RX